# EAGLE design PBag (EAGLE 9.6.2)
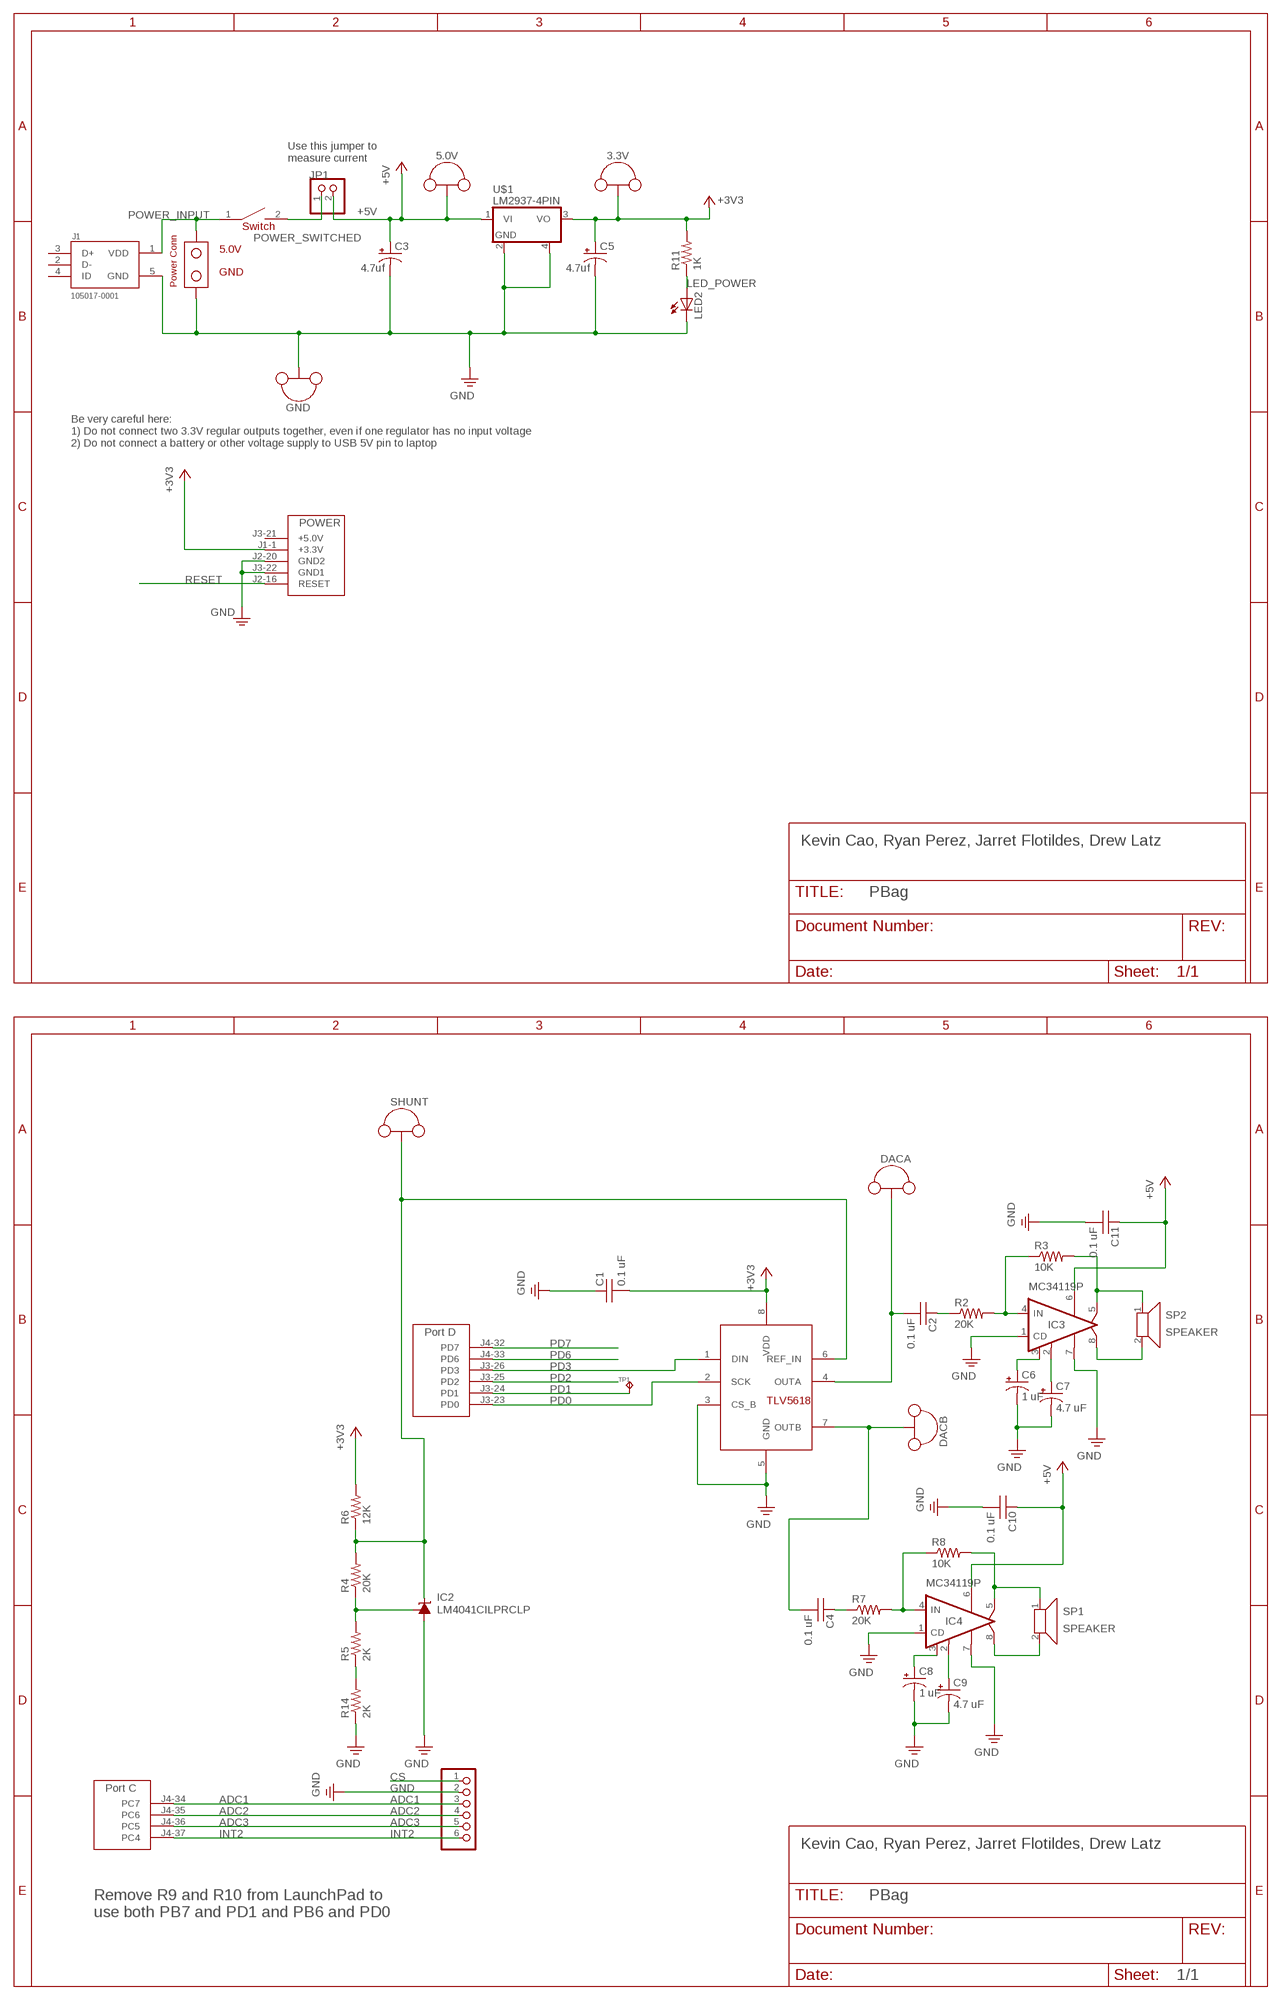
[diagram p0: schematic, sheet 1, part 1 of 2]
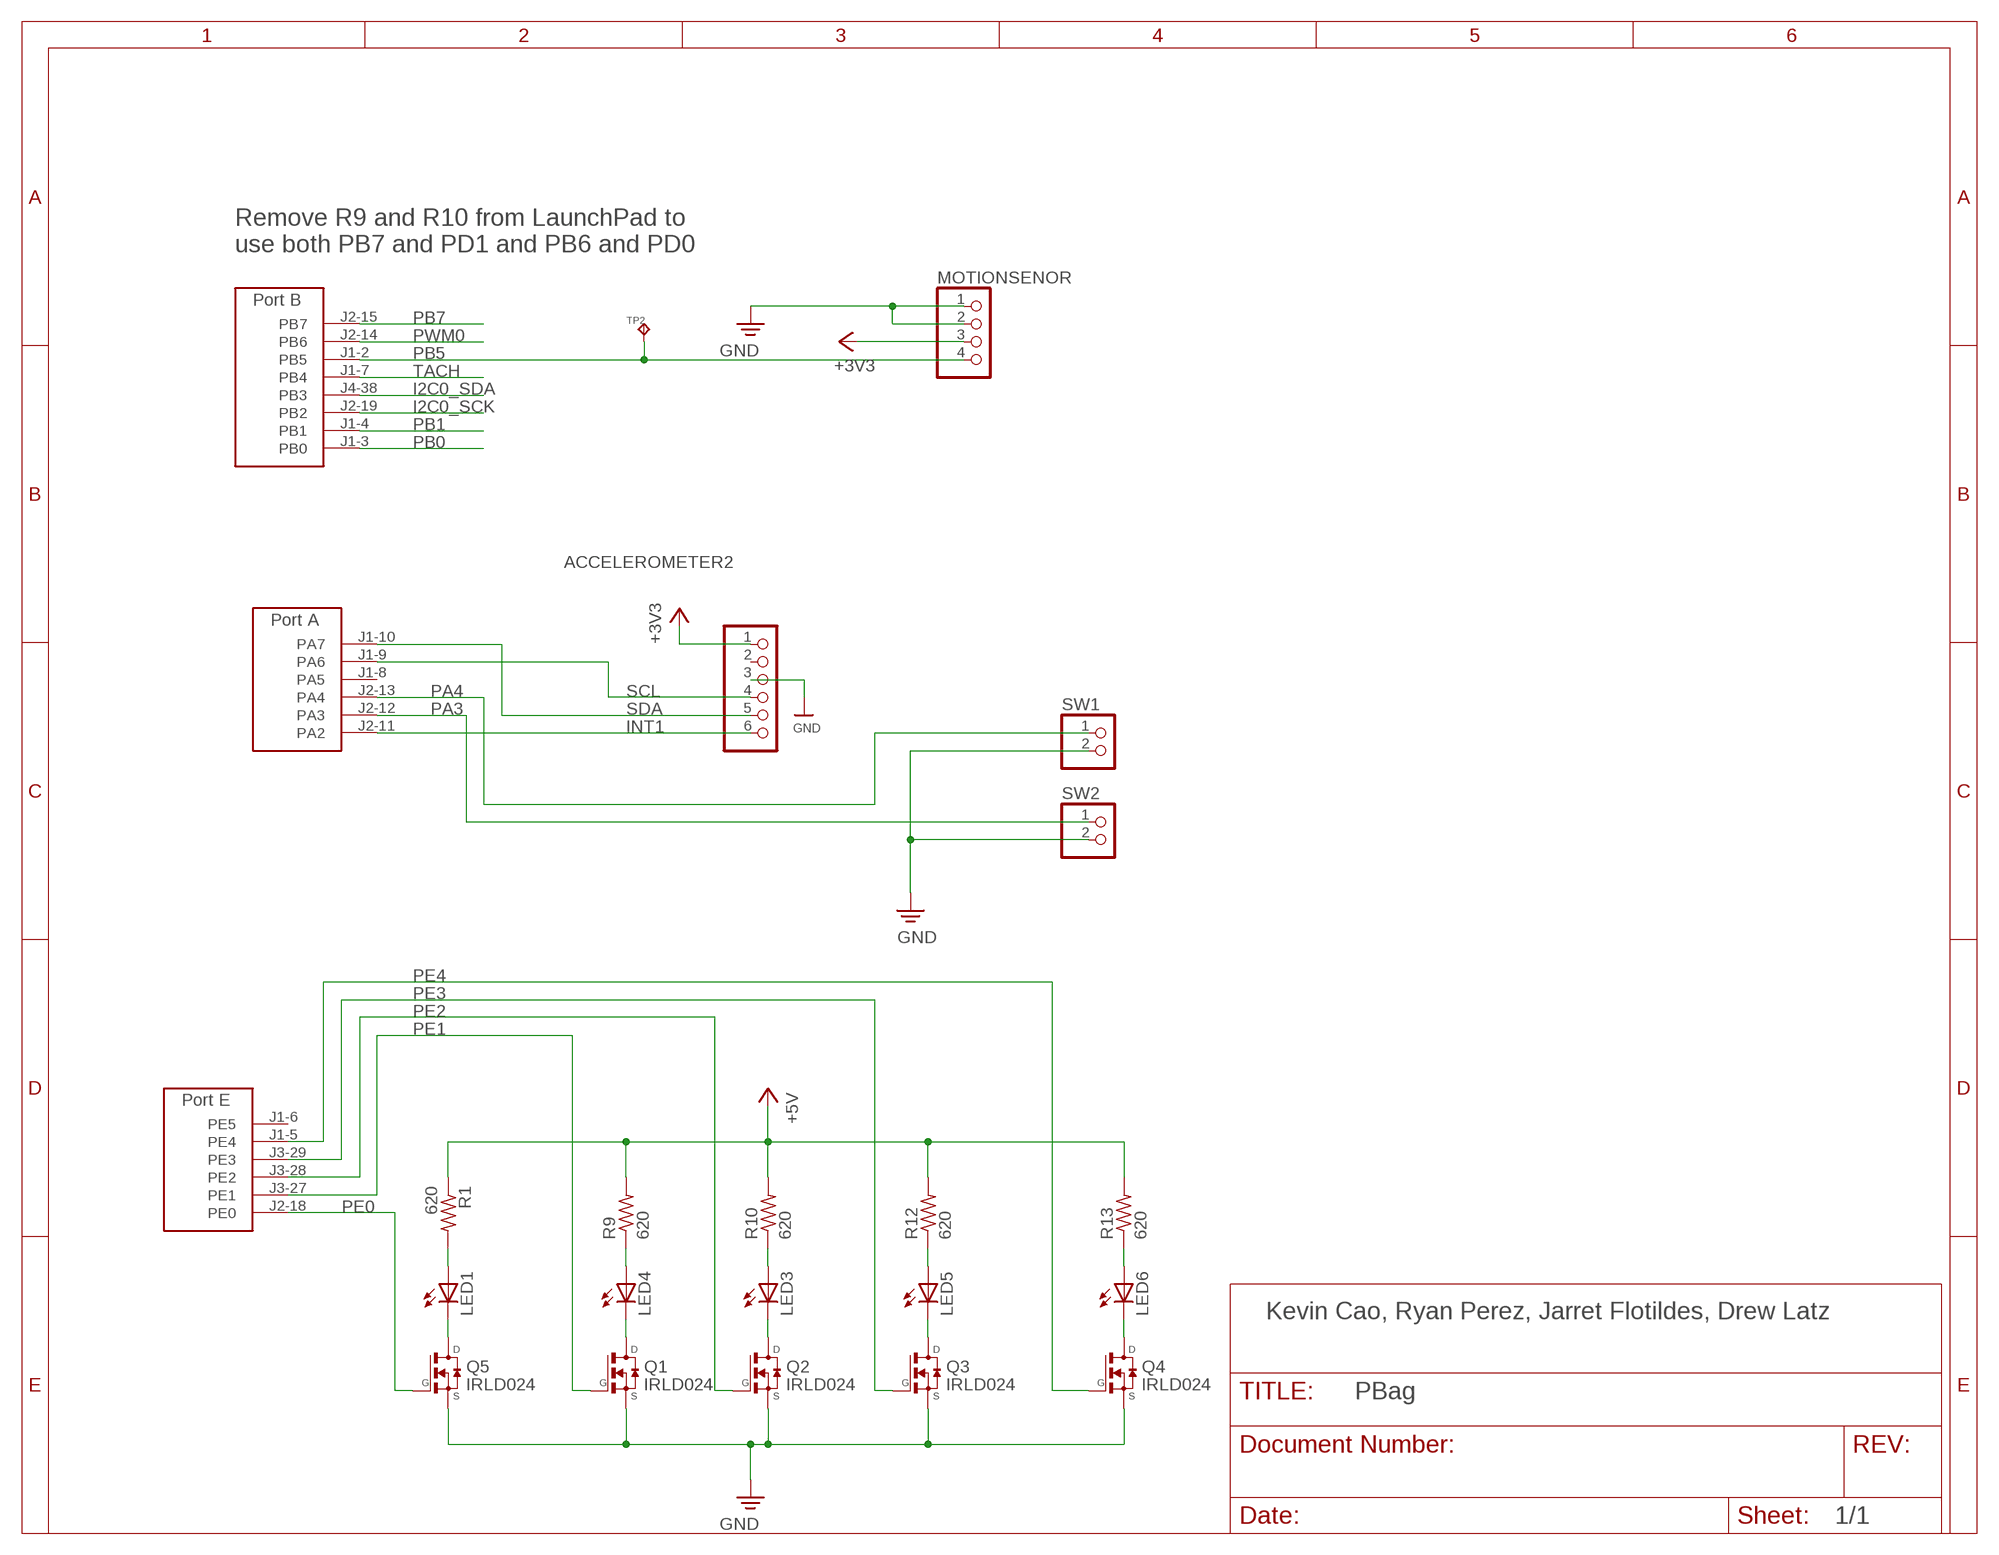
[diagram p1: schematic, sheet 1, part 2 of 2]

## Parts
3.3V  TP_LOOP  [TP_LOOP]
5.0V  TP_LOOP  [TP_LOOP]
ACCELEROMETER1  HEADER-1X670MIL  [1X06_ROUND_70]
ACCELEROMETER2  HEADER-1X670MIL  [1X06_ROUND_70]
C1  0.1 uF  CAPACITOR025-024X044  [CAP100MIL]
C2  0.1 uF  CAPACITOR025-024X044  [CAP100MIL]
C3  4.7uf  CAPACITOR_POLARIZEDE5-6  [CAP200MILPOLARIZED]
C4  0.1 uF  CAPACITOR025-024X044  [CAP100MIL]
C5  4.7uf  CAPACITOR_POLARIZEDE5-6  [CAP200MILPOLARIZED]
C6  1 uF  CAPACITOR_POLARIZEDE5-6  [CAP200MILPOLARIZED]
C7  4.7 uF  CAPACITOR_POLARIZEDE5-6  [CAP200MILPOLARIZED]
C8  1 uF  CAPACITOR_POLARIZEDE5-6  [CAP200MILPOLARIZED]
C9  4.7 uF  CAPACITOR_POLARIZEDE5-6  [CAP200MILPOLARIZED]
C10  0.1 uF  CAPACITOR025-024X044  [CAP100MIL]
C11  0.1 uF  CAPACITOR025-024X044  [CAP100MIL]
DAC  TLV5618  [DIL08]
DACA  TP_LOOP  [TP_LOOP]
DACB  TP_LOOP  [TP_LOOP]
GND  TP_LOOP  [TP_LOOP]
IC2  LM4041CILPRCLP  [LP_O-PBCY-W3]
IC3  MC34119P  [DIL08]
IC4  MC34119P  [DIL08]
J1  105017-0001  [MOLEX_105017-0001]
JP1  PINHD-1X2  [1X02]
LED1  LED5MM  [LED5MM]
LED2  LED3MM  [LED3MM]
LED3  LED5MM  [LED5MM]
LED4  LED5MM  [LED5MM]
LED5  LED5MM  [LED5MM]
LED6  LED5MM  [LED5MM]
MOTIONSENOR  PINHD-1X4/90  [1X04/90]
Q1  IRLD024  [IRLD024]
Q2  IRLD024  [IRLD024]
Q3  IRLD024  [IRLD024]
Q4  IRLD024  [IRLD024]
Q5  IRLD024  [IRLD024]
R1  620  RESISTOR0204/5  [RES200MIL]
R2  20K  RESISTOR0204/5  [RES200MIL]
R3  10K  RESISTOR0204/5  [RES200MIL]
R4  20K  RESISTOR0204/5  [RES200MIL]
R5  2K  RESISTOR0204/5  [RES200MIL]
R6  12K  RESISTOR0204/5  [RES200MIL]
R7  20K  RESISTOR0204/5  [RES200MIL]
R8  10K  RESISTOR0204/5  [RES200MIL]
R9  620  RESISTOR0204/5  [RES200MIL]
R10  620  RESISTOR0204/5  [RES200MIL]
R11  1K  RESISTOR0204/5  [RES200MIL]
R12  620  RESISTOR0204/5  [RES200MIL]
R13  620  RESISTOR0204/5  [RES200MIL]
R14  2K  RESISTOR0204/5  [RES200MIL]
SHUNT  TP_LOOP  [TP_LOOP]
SP1  SPEAKER  [1X02]
SP2  SPEAKER  [1X02]
SW1  PINHD-1X2  [1X02]
SW2  PINHD-1X2  [1X02]
TP1  TP_KEYSTONE500X  [P1.1MM]
TP2  TP_KEYSTONE500X  [P1.1MM]
U$1  LM2937-4PIN  [TO220-4PIN]
U$2  TM4C_BP  [TM4C_BOOSTER_PACK]
U$5  POWER_CONN  [POWER_CONN]
U$6  SW_POWER_100MIL  [SW_POWER]

## Nets
+3V3: 3.3V.P$1(TP) 3.3V.P$2(TP) ACCELEROMETER2.1 C1.2 C5.+ DAC.8(VDD) MOTIONSENOR.3 R6.2 R11.2 U$1.3(VO) U$2.J1-1(+3.3V)
+5V: 5.0V.P$1(TP) 5.0V.P$2(TP) C3.+ C10.1 C11.1 IC3.6(VCC) IC4.6(VCC) JP1.2 R1.1 R9.2 R10.2 R12.2 R13.2 U$1.1(VI)
ADC1: ACCELEROMETER1.3 U$2.J4-34(PC7)
ADC2: ACCELEROMETER1.4 U$2.J4-35(PC6)
ADC3: ACCELEROMETER1.5 U$2.J4-36(PC5)
CS: ACCELEROMETER1.1
GND: ACCELEROMETER1.2 ACCELEROMETER2.3 C1.1 C3.- C5.- C6.- C7.- C8.- C9.- C10.2 C11.2 DAC.3(CS_B) DAC.5(GND) GND.P$1(TP) GND.P$2(TP) IC2.3(A) IC3.1(CD) IC3.7(GND) IC4.1(CD) IC4.7(GND) J1.5(GND) LED2.K(C) MOTIONSENOR.1 MOTIONSENOR.2 Q1.P$4(S) Q2.P$4(S) Q3.P$4(S) Q4.P$4(S) Q5.P$4(S) R14.1 SW1.2 SW2.2 U$1.2(GND) U$1.4(PAD) U$2.J2-20(GND2) U$2.J3-22(GND1) U$5.GND
I2C0_SCK: U$2.J2-19(PB2)
I2C0_SDA: U$2.J4-38(PB3)
INT1: ACCELEROMETER2.6 U$2.J2-11(PA2)
INT2: ACCELEROMETER1.6 U$2.J4-37(PC4)
LED1: LED1.A R1.2
LED1D: LED1.K(C) Q5.P$1(D)
LED3: LED3.A R10.1
LED3D: LED3.K(C) Q2.P$1(D)
LED4: LED4.A R9.1
LED4D: LED4.K(C) Q1.P$1(D)
LED5: LED5.A R12.1
LED5D: LED5.K(C) Q3.P$1(D)
LED6: LED6.A R13.1
LED6D: LED6.K(C) Q4.P$1(D)
LED_POWER: LED2.A R11.1
MC1C6: C6.+ IC3.3(FC1)
MC1C7: C7.+ IC3.2(FC2)
MC1IN: IC3.4(IN) R2.2 R3.1
MC2C8: C8.+ IC4.3(FC1)
MC2C9: C9.+ IC4.2(FC2)
MC2IN: IC4.4(IN) R7.2 R8.1
OUTA: C2.2 DAC.4(OUTA) DACA.P$1(TP) DACA.P$2(TP)
OUTACON: C2.1 R2.1
OUTB: C4.2 DAC.7(OUTB) DACB.P$1(TP) DACB.P$2(TP)
OUTBCON: C4.1 R7.1
PA3: SW2.1 U$2.J2-12(PA3)
PA4: SW1.1 U$2.J2-13(PA4)
PB0: U$2.J1-3(PB0)
PB1: U$2.J1-4(PB1)
PB5: MOTIONSENOR.4 TP2.TP U$2.J1-2(PB5)
PB7: U$2.J2-15(PB7)
PD0: DAC.2(SCK) U$2.J3-23(PD0)
PD1: TP1.TP U$2.J3-24(PD1)
PD2: U$2.J3-25(PD2)
PD3: DAC.1(DIN) U$2.J3-26(PD3)
PD6: U$2.J4-33(PD6)
PD7: U$2.J4-32(PD7)
PE0: Q5.P$3(G) U$2.J2-18(PE0)
PE1: Q1.P$3(G) U$2.J3-27(PE1)
PE2: Q2.P$3(G) U$2.J3-28(PE2)
PE3: Q3.P$3(G) U$2.J3-29(PE3)
PE4: Q4.P$3(G) U$2.J1-5(PE4)
POWER_INPUT: J1.1(VDD) U$5.VDD U$6.1
POWER_SWITCHED: JP1.1 U$6.2
PWM0: U$2.J2-14(PB6)
R5-14: R5.1 R14.2
RESET: U$2.J2-16(RESET)
SCL: ACCELEROMETER2.4 U$2.J1-9(PA6)
SDA: ACCELEROMETER2.5 U$2.J1-10(PA7)
SHUNT: IC2.1(FB) R4.1 R5.2
SHUNTREFIN: DAC.6(REF_IN) IC2.2(C) R4.2 R6.1 SHUNT.P$1(TP) SHUNT.P$2(TP)
SP15: IC4.5(VO1) R8.2 SP1.1
SP18: IC4.8(VO2) SP1.2
SP25: IC3.5(VO1) R3.2 SP2.1
SP28: IC3.8(VO2) SP2.2
TACH: U$2.J1-7(PB4)
Unconnected: ACCELEROMETER2.2 J1.2(D-) J1.3(D+) J1.4(ID) U$2.J1-6(PE5) U$2.J1-8(PA5) U$2.J2-17(PF0) U$2.J3-21(+5.0V) U$2.J3-30(PF1) U$2.J4-31(PF4) U$2.J4-39(PF3) U$2.J4-40(PF2)

## Notes on the sheet
- Use this jumper to
  measure current
- Be very careful here:
  1) Do not connect two 3.3V regular outputs together, even if one regulator has no input voltage
  2) Do not connect a battery or other voltage supply to USB 5V pin to laptop
- Kevin Cao, Ryan Perez, Jarret Flotildes, Drew Latz
- Remove R9 and R10 from LaunchPad to
  use both PB7 and PD1 and PB6 and PD0
- Kevin Cao, Ryan Perez, Jarret Flotildes, Drew Latz
- Kevin Cao, Ryan Perez, Jarret Flotildes, Drew Latz
- Remove R9 and R10 from LaunchPad to
  use both PB7 and PD1 and PB6 and PD0

## Library data of the parts
3.3V 5.0V DACA DACB GND SHUNT = EE445L:TP_LOOP
ACCELEROMETER1 ACCELEROMETER2 = microbuilder:HEADER-1X6: PIN HEADER
C1 C2 C4 = EE445L (1):CAPACITOR: CAPACITOR, American symbol
C3 C5 = EE445L:CAPACITOR_POLARIZED: POLARIZED CAPACITOR, American symbol
C6-C9 = EE445L (1):CAPACITOR_POLARIZED: POLARIZED CAPACITOR, American symbol
C10 C11 = EE445L:CAPACITOR: CAPACITOR, American symbol
DAC = EE445L (1):TLV5618: The TLV5618A is a dual 12-bit voltage output DAC with a flexible 3-wire serial interface. The serial interface is compatible with TMS320, SPI, QSPI, and Microwire serial ports. It is programmed with a 16-bit serial string containing 4 control and 12 data bits
IC2 = EE445L (1):LM4041CILPR: PRECISION MICROPOWER SHUNT VOLTAGE REFERENCE Adjustable Output Source: http://focus.ti.com/lit/ds/slcs146e/slcs146e.pdf LM4041CILPR Let R1 be the resistor from Vref to +3.3V Let R2 be the resistor from Vref to FB Let R3 be the resistor from FB to ground Vref = 1.23*(1+R3/R2) Iref=(3.3V-Vref)/R1 - 100uA; MPN: LM4041CILP; OC_FARNELL: 1673945; OC_NEWARK: 50M8856
IC3 IC4 = EE445L (1):MC34119: Low Power Audio Amplifier Motorola
J1 = 105017-0001:105017-0001: Check availability <https://pricing.snapeda.com/parts/105017-0001/Molex/view-part?ref=eda>; AVAILABILITY: In Stock; DESCRIPTION: USB - micro B USB 2.0 Receptacle Connector 5 Position Surface Mount, Right Angle; Through Hole; MF: Molex; MP: 105017-0001; PACKAGE: None; PRICE: None; PURCHASE-URL: https://pricing.snapeda.com/search/part/105017-0001/?ref=eda
JP1 SW1 SW2 = EE445L:PINHD-1X2: PIN HEADER
LED1 LED3-LED6 = EE445L (3):LED: Avago Technologies LED Green 2mA 5mm diffused, HLMP-4740, Digikey 516-1327-ND Red 1.6V 1mA 5mm diffused, HLMP-D150, Digikey 516-1323-ND Yellow 2mA 5mm diffused, HLMP-4719, Digikey 516-1326-ND Orange 10mA 5mm diffused HLMP-D401, Digikey 516-1330-ND Blue 10mA 5mm diffused
LED2 = EE445L:LED: Avago Technologies LED Green 2mA 5mm diffused, HLMP-4740, Digikey 516-1327-ND Red 1.6V 1mA 5mm diffused, HLMP-D150, Digikey 516-1323-ND Yellow 2mA 5mm diffused, HLMP-4719, Digikey 516-1326-ND Orange 10mA 5mm diffused HLMP-D401, Digikey 516-1330-ND Blue 10mA 5mm diffused
MOTIONSENOR = EE445L (1):PINHD-1X4: PIN HEADER
Q1-Q5 = EE445L (3):IRLD024: N-Channel Enhancement MOSFET
R1 R9 R10 R12 R13 = EE445L (3):RESISTOR: RESISTOR, American symbol
R2 R3 R7 R8 = EE445L (1):RESISTOR: RESISTOR, American symbol
R4-R6 R11 R14 = EE445L:RESISTOR: RESISTOR, American symbol
SP1 SP2 = EE445L (1):SPEAKER: Speaker Connected off PCB with two wires. 32-ohm speaker, AllElectronics, SK-230, http://www.allelectronics.com/make-a-store/item/sk-230/20-mm-32-ohm-speaker/1.html
TP1 TP2 = EE445L:TP: Test pad Test point, black, Keystone Electronics 5001, Digikey 5001K-ND Test point, orange, Keystone Electronics 5003, Digikey 5003K-ND Test point, yellow, Keystone Electronics 5004, Digikey 5004K-ND Test point, white, Keystone Electronics 5002, Digikey 5002K-ND Test point, red, Keystone Electronics 5000, Digikey 5000K-ND
U$1 = EE445L:LM2937-4PIN
U$2 = EE445L:TM4C_BP
U$5 = EE445L:POWER_CONN
U$6 = EE445L:SW_POWER_100MIL

## Net classes
1 highpower: width 0.406 mm, drill 0.483 mm
2 lowpower: width 0.305 mm, drill 0.483 mm

## Board
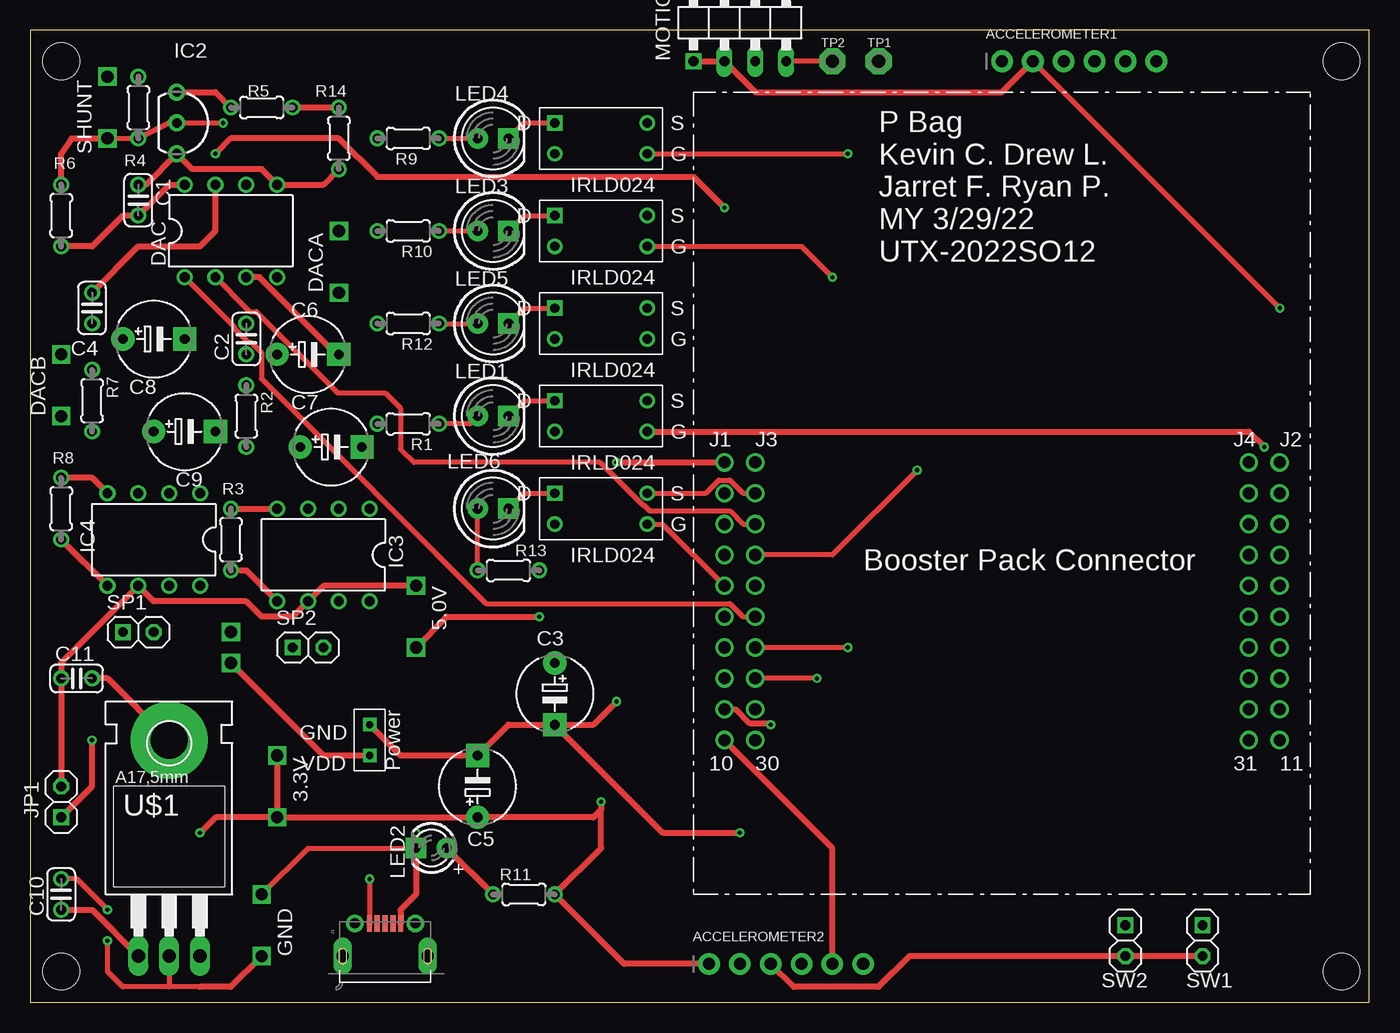
[diagram p2: board, top side]
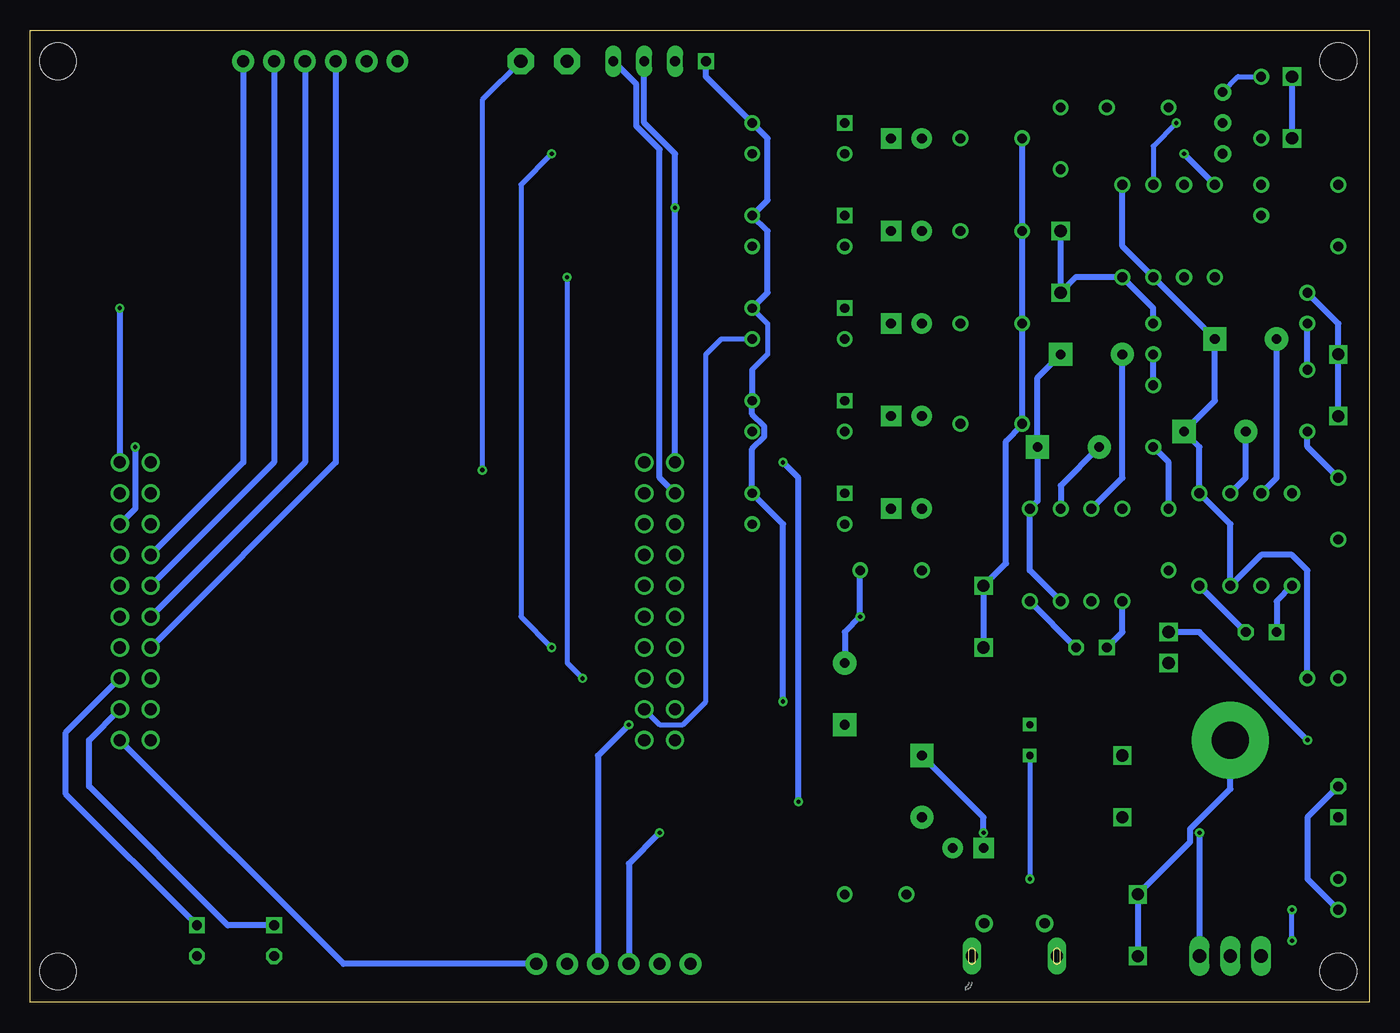
[diagram p3: board, bottom side, seen from below]

Size 110.24 x 80.01 mm. Coordinates in mm from the lower left corner, seen from the top.
Outline: 0,0 110.24,0 110.24,80.01 0,80.01 0,0
Copper layers (1*16): Top 0.035mm / dielectric 1.5mm / Bottom 0.035mm
Design rules "default *": minimum track width 5mil, minimum drill 12mil, track to track 5mil, track to pad 5mil, pad to pad 5mil, via to via 5mil, smd to smd 5mil, copper to edge 8mil, drill to drill 6mil, minimum pad ring 10mil, minimum via ring 8mil, stop-mask expansion 4mil, vias tented up to drill 0mil, thermal gap 10mil
Holes 3 mm at 2.54,77.47 2.54,2.54 107.95,2.54 107.95,77.47

### Footprints (pad centres in the part's own frame; a part is rotated, then mirrored left to right if it is on the bottom)
TP_LOOP = drill 1 square: P$1 0,0; P$2 5.08,0
1X06_ROUND_70 = drill 1 pad 1.778: 1 -6.35,0; 2 -3.81,0; 3 -1.27,0; 4 1.27,0; 5 3.81,0; 6 6.35,0
CAP100MIL = drill 0.8: 1 -1.27,0; 2 1.27,0
CAP200MILPOLARIZED = drill 0.8 pad 1.905: + -2.54,0 | drill 0.8 pad 1.905 square: - 2.54,0
DIL08 = drill 0.813 pad 1.27: 1 -3.81,-3.81; 2 -1.27,-3.81; 3 1.27,-3.81; 4 3.81,-3.81; 5 3.81,3.81; 6 1.27,3.81; 7 -1.27,3.81; 8 -3.81,3.81
LP_O-PBCY-W3 = drill 0.8 pad 1.4: 1 -2.54,0; 2 0,0; 3 2.54,0
MOLEX_105017-0001 = smd 0.4 x 1.35: 1 -1.3,2.675; 2 -0.65,2.675; 3 0,2.675; 4 0.65,2.675; 5 1.3,2.675 | drill 0.85 pad 1.45: P$1 -2.5,2.7; P$2 2.5,2.7 | drill 1.016 pad 1.27 long: P$12 -3.5,0; P$13 3.5,0
1X02 = drill 0.8 square: 1 -1.27,0 | drill 0.8 octagon: 2 1.27,0
LED5MM = drill 0.8 pad 1.676: A -1.27,0 | drill 0.8 pad 1.676 square: K 1.27,0
LED3MM = drill 0.8 pad 1.676: A -1.27,0 | drill 0.8 pad 1.676 square: K 1.27,0
1X04/90 = drill 0.8 square: 1 -3.81,-3.81 | drill 0.8 long: 2 -1.27,-3.81; 3 1.27,-3.81; 4 3.81,-3.81
IRLD024 = drill 0.75 square: P$1 0,0 | drill 0.75: P$2 0,-2.54; P$3 7.62,-2.54; P$4 7.62,0
RES200MIL = drill 0.8: 1 -2.54,0; 2 2.54,0
P1.1MM = drill 1.1 pad 2.159 octagon: TP 0,0
TO220-4PIN = drill 1.1 long: 1 -2.54,-6.35; 2 0,-6.35; 3 2.54,-6.35 | drill 3.048 pad 6.35: 4 0,11.43
TM4C_BOOSTER_PACK = drill 1: J1-1 0,22.86; J1-2 0,20.32; J1-3 0,17.78; J1-4 0,15.24; J1-5 0,12.7; J1-6 0,10.16; J1-7 0,7.62; J1-8 0,5.08; J1-9 0,2.54; J1-10 0,0; J2-11 45.72,0; J2-12 45.72,2.54; J2-13 45.72,5.08; J2-14 45.72,7.62; J2-15 45.72,10.16; J2-16 45.72,12.7; J2-17 45.72,15.24; J2-18 45.72,17.78; J2-19 45.72,20.32; J2-20 45.72,22.86; J3-21 2.54,22.86; J3-22 2.54,20.32; J3-23 2.54,17.78; J3-24 2.54,15.24; J3-25 2.54,12.7; J3-26 2.54,10.16; J3-27 2.54,7.62; J3-28 2.54,5.08; J3-29 2.54,2.54; J3-30 2.54,0; J4-31 43.18,0; J4-32 43.18,2.54; J4-33 43.18,5.08; J4-34 43.18,7.62; J4-35 43.18,10.16; J4-36 43.18,12.7; J4-37 43.18,15.24; J4-38 43.18,17.78; J4-39 43.18,20.32; J4-40 43.18,22.86
POWER_CONN = drill 0.6 square: GND 2.54,0; VDD 0,0
SW_POWER = drill 1.016 square: 1 -1.27,0; 2 1.27,0

### Placement (x,y rotation side)
3.3V  20.32,15.24 90 top
5.0V  31.75,34.29 270 top
ACCELEROMETER1  86.36,77.47 0 top
ACCELEROMETER2  62.23,3.17 0 top
C1  8.89,66.04 270 top
C2  17.78,54.61 90 top
C3  43.18,25.4 270 top
C4  5.08,57.15 90 top
C5  36.83,17.78 90 top
C6  22.86,53.34 0 top
C7  24.77,45.72 0 top
C8  10.16,54.61 0 top
C9  12.7,46.99 0 top
C10  2.54,8.89 90 top
C11  3.81,26.67 0 top
DAC  16.51,63.5 0 top
DACA  25.4,58.42 90 top
DACB  2.54,48.26 90 top
GND  19.05,3.81 90 top
IC2  12.06,72.39 270 top
IC3  24.13,36.83 180 top
IC4  10.16,38.1 180 top
J1  29.21,3.81 0 top
JP1  2.54,16.51 90 top
LED1  38.1,48.26 0 top
LED2  33.02,12.7 180 top
LED3  38.1,63.5 0 top
LED4  38.1,71.12 0 top
LED5  38.1,55.88 0 top
LED6  38.1,40.64 0 top
MOTIONSENOR  58.42,81.28 0 top
Q1  43.18,72.39 0 top
Q2  43.18,64.77 0 top
Q3  43.18,57.15 0 top
Q4  43.18,41.91 0 top
Q5  43.18,49.53 0 top
R1  31.11,47.62 0 top
R2  17.78,48.26 270 top
R3  16.51,38.1 270 top
R4  8.89,73.66 270 top
R5  19.05,73.66 180 top
R6  2.54,64.77 270 top
R7  5.08,49.53 270 top
R8  2.54,40.64 270 top
R9  31.11,71.12 180 top
R10  31.11,63.5 180 top
R11  40.64,8.89 0 top
R12  31.11,55.88 180 top
R13  39.37,35.56 0 top
R14  25.4,71.12 90 top
SHUNT  6.35,71.12 90 top
SP1  8.89,30.48 0 top
SP2  22.86,29.21 0 top
SW1  96.52,5.08 270 top
SW2  90.17,5.08 270 top
TP1  69.85,77.47 0 top
TP2  66.04,77.47 180 top
U$1  11.43,10.16 0 top
U$2  57.15,21.59 0 top
U$5  27.94,20.32 90 top
U$6  16.51,29.21 90 top

### Tracks (layer width: path | path; a pad name or v marks a point on that pad's centre or on a via)
+3V3  (via drill 0.35)
  Top 0.508: 3.3V.P$2 3.3V.P$1 | 3.3V.P$1 15.24,15.24 v13.97,13.97 | 3.3V.P$1 C5.+ 46.35,15.24 46.99,15.88 | v46.99,16.51 46.99,15.88 | v48.26,44.45 U$2.J1-1 | v15.24,69.85 16.51,71.12 25.4,71.12 28.57,67.94 54.61,67.94 v57.15,65.41 | R6.2 5.08,62.23 7.62,64.77 C1.2 11.43,67.31 DAC.8 | 46.99,15.88 46.99,12.7 R11.2 48.9,3.17 ACCELEROMETER2.1
  Bottom 0.508: v13.97,13.97 U$1.3 | v46.99,16.51 46.99,43.18 v48.26,44.45 | U$2.J1-1 v57.15,65.41 57.15,69.85 59.69,72.39 MOTIONSENOR.3 | v15.24,69.85 DAC.8
+5V  (via drill 0.35)
  Top 0.508: 5.0V.P$2 34.29,31.75 v41.91,31.75 | 5.0V.P$1 24.13,34.29 IC3.6 21.59,31.75 19.05,31.75 17.78,33.02 10.16,33.02 IC4.6 2.54,27.94 C11.1 JP1.2 | C10.1 5.08,7.62 U$1.1
  Bottom 0.508: 5.0V.P$2 5.0V.P$1 29.91,36.13 29.91,46.2 28.57,47.53 R1.1 R12.2 R10.2 R9.2 | R13.2 v41.91,31.75 43.18,30.48 C3.+ | JP1.2 5.08,15.24 5.08,10.16 C10.1
ADC1
  Bottom 0.508: ACCELEROMETER1.3 85.09,44.45 U$2.J4-34
ADC2
  Bottom 0.508: ACCELEROMETER1.4 87.63,44.45 U$2.J4-35
ADC3
  Bottom 0.508: ACCELEROMETER1.5 90.17,44.45 U$2.J4-36
GND  (via drill 0.35)
  Top 0.406: Q4.P$4 55.62,41.91 56.7,42.99 57.6,42.99 58.68,41.91 U$2.J3-22 | GND.P$2 22.86,12.7 LED2.K | 13.97,1.27 11.43,1.27 | 11.43,1.27 7.62,1.27 6.35,2.54 v6.35,5.08 | v6.35,7.62 3.81,10.16 C10.2 | U$1.2 11.43,1.27 | ACCELEROMETER1.2 v102.87,57.15
  Top 0.508: 13.97,1.27 16.51,1.27 GND.P$1 | v31.75,13.97 LED2.K 31.75,8.89 30.48,7.62 30.48,6.51 J1.5 | C3.- 39.37,22.86 C5.- 30.48,20.32 U$5.GND | C3.- 52.07,13.97 v58.42,13.97 | MOTIONSENOR.1 MOTIONSENOR.2 59.69,74.93 80.01,74.93 ACCELEROMETER1.2 | U$1.4 6.35,26.67 C11.2 | C1.1 9.53,67.31 IC2.3 13.34,68.58 19.05,68.58 DAC.5 24.13,67.31 R14.1 | C6.- 25.2,53.34 18.85,59.69 DAC.3 | C3.- 46.35,22.86 v48.26,24.77 | SW2.2 SW1.2 72.39,3.81 69.85,1.27 62.87,1.27 ACCELEROMETER2.3
  Bottom 0.406: v6.35,5.08 v6.35,7.62 | Q3.P$4 49.53,55.88 49.53,53.34 50.8,52.07
  Bottom 0.508: GND.P$1 GND.P$2 14.73,13.21 14.73,14.28 11.43,17.58 U$1.4 | v31.75,13.97 31.75,15.24 C5.- | v58.42,13.97 60.96,11.43 ACCELEROMETER2.3 | 50.8,52.07 Q5.P$4 50.8,48.42 49.79,47.41 49.79,46.57 50.8,45.56 Q4.P$4 48.26,39.37 v48.26,24.77 | Q3.P$4 49.53,58.42 49.53,63.5 Q2.P$4 49.53,66.04 49.53,71.12 Q1.P$4 54.61,76.2 MOTIONSENOR.1 | v102.87,57.15 U$2.J2-20 | C11.2 5.08,35.56 6.35,36.83 8.89,36.83 IC4.7 11.43,39.37 IC4.1 13.97,45.72 C9.- 12.7,49.53 C8.- DAC.3 20.32,62.23 DAC.5 | IC3.7 27.94,35.56 IC3.1 27.3,41.27 C7.- 27.3,51.44 C6.-
INT1
  Bottom 0.508: ACCELEROMETER2.6 84.45,3.17 U$2.J2-11
INT2
  Bottom 0.508: ACCELEROMETER1.6 92.71,44.45 U$2.J4-37
LED1
  Top 0.406: LED1.A 36.2,47.62 R1.2
LED1D
  Top 0.406: LED1.K 40.64,49.53 Q5.P$1
LED3
  Top 0.406: R10.1 LED3.A
LED3D
  Top 0.406: LED3.K 40.64,64.77 Q2.P$1
LED4
  Top 0.406: R9.1 LED4.A
LED4D
  Top 0.406: LED4.K 40.64,72.39 Q1.P$1
LED5
  Top 0.406: R12.1 LED5.A
LED5D
  Top 0.406: LED5.K 40.64,57.15 Q3.P$1
LED6
  Top 0.406: R13.1 LED6.A
LED6D
  Top 0.406: LED6.K 40.64,41.91 Q4.P$1
LED_POWER
  Top 0.508: LED2.A R11.1
MC1C6
  Bottom 0.508: IC3.3 20.32,43.18 C6.+
MC1C7
  Bottom 0.508: C7.+ 25.4,42.55 IC3.2
MC1IN
  Top 0.508: R3.1 IC3.4
  Bottom 0.508: R3.1 16.51,44.45 R2.2
MC2C8
  Bottom 0.508: IC4.3 7.62,43.18 C8.+
MC2C9
  Bottom 0.508: IC4.2 10.16,43.18 C9.+
MC2IN
  Top 0.508: IC4.4 5.08,43.18 R8.1
  Bottom 0.508: R8.1 5.08,45.72 R7.2
OUTA
  Bottom 0.508: C2.2 17.78,57.15 DAC.4 24.13,59.69 DACA.P$1 DACA.P$2
OUTACON
  Bottom 0.508: R2.1 C2.1
OUTB
  Top 0.508: C4.2 8.89,62.23 13.97,62.23 15.24,63.5 DAC.7
  Bottom 0.508: DACB.P$1 DACB.P$2 2.54,55.88 C4.2
OUTBCON
  Bottom 0.508: R7.1 C4.1
PA3
  Bottom 0.508: SW2.1 93.98,6.35 105.41,17.78 105.41,21.59 U$2.J2-12
PA4
  Bottom 0.508: SW1.1 107.31,17.14 107.31,22.23 U$2.J2-13
PB5
  Top 0.406: TP2.TP MOTIONSENOR.4
  Bottom 0.508: U$2.J1-2 58.42,43.18 58.42,70.22 60.33,72.13 60.33,75.56 MOTIONSENOR.4
PD0
  Top 0.406: DAC.2 17.78,57.15 18.07,56.86 18.61,56.86 25.31,50.16 29.21,50.16 30.48,48.9 30.48,45.55 31.58,44.45 46.9,44.45 50.4,40.95 50.49,40.95 50.99,40.45 57.6,40.45 58.68,39.37 U$2.J3-23
PD1  (via drill 0.35)
  Top 0.406: v73.03,43.81 66.04,36.83 U$2.J3-24
  Bottom 0.406: TP1.TP 73.03,74.3 v73.03,43.81
PD3
  Top 0.406: DAC.1 16.8,55.59 16.8,55.47 17.94,54.32 18.19,54.32 19.04,53.48 19.04,51.33 37.53,32.83 57.6,32.83 58.68,31.75 U$2.J3-26
PE0  (via drill 0.35)
  Top 0.508: Q5.P$3 100.33,46.99 v101.6,45.72
  Bottom 0.508: v101.6,45.72 101.6,40.64 U$2.J2-18
PE1  (via drill 0.35)
  Top 0.406: Q1.P$3 v67.31,69.85 | v67.31,29.21 U$2.J3-27
  Bottom 0.406: v67.31,69.85 69.85,67.31 69.85,31.75 v67.31,29.21
PE2  (via drill 0.35)
  Top 0.406: Q2.P$3 63.5,62.23 v66.04,59.69 | v64.77,26.67 U$2.J3-28
  Bottom 0.406: v66.04,59.69 66.04,27.94 v64.77,26.67
PE3
  Bottom 0.406: U$2.J3-29 58.42,22.86 56.52,22.86 54.61,24.77 54.61,53.34 53.34,54.61 Q3.P$3
PE4
  Top 0.406: Q4.P$3 52.07,39.37 U$2.J1-5
POWER_INPUT  (via drill 0.35)
  Top 0.406: v27.94,10.16 27.94,6.51
  Top 0.508: 27.94,6.51 J1.1 | U$5.VDD 24.13,20.32 U$6.1
  Bottom 0.406: U$5.VDD v27.94,10.16
POWER_SWITCHED  (via drill 0.35)
  Top 0.508: JP1.1 5.08,17.78 v5.08,21.59
  Bottom 0.508: v5.08,21.59 13.97,30.48 U$6.2
R5-14
  Top 0.508: R14.2 R5.1
SCL  (via drill 0.35)
  Top 0.508: U$2.J1-9 58.09,24.13 59.22,23 60.83,23 v60.96,22.86
  Bottom 0.508: v60.96,22.86 63.5,20.32 ACCELEROMETER2.4
SDA
  Top 0.508: ACCELEROMETER2.5 66.04,12.7 U$2.J1-10
SHUNT
  Top 0.508: IC2.1 15.24,74.93 R5.2
  Bottom 0.406: IC2.1 10.79,76.2 R4.1
SHUNTREFIN  (via drill 0.35)
  Top 0.406: SHUNT.P$1 R4.2 | IC2.2 v15.88,72.39
  Top 0.508: R6.1 2.54,69.85 3.39,71.12 SHUNT.P$1 | R4.2 11.43,72.39 IC2.2
  Bottom 0.406: v15.88,72.39 17.78,70.48 DAC.6
  Bottom 0.508: SHUNT.P$2 SHUNT.P$1
SP15
  Top 0.508: R8.2 IC4.5
  Bottom 0.508: IC4.5 7.62,33.02 SP1.1
SP18
  Bottom 0.508: SP1.2 IC4.8
SP25
  Top 0.508: R3.2 17.78,35.56 IC3.5
  Bottom 0.508: SP2.1 20.32,30.48 IC3.5
SP28
  Bottom 0.508: IC3.8 SP2.2

### Text on the board
tPlace: P Bag / Kevin C. Drew L. / Jarret F. Ryan P. / MY 3/29/22 / UTX-2022SO12